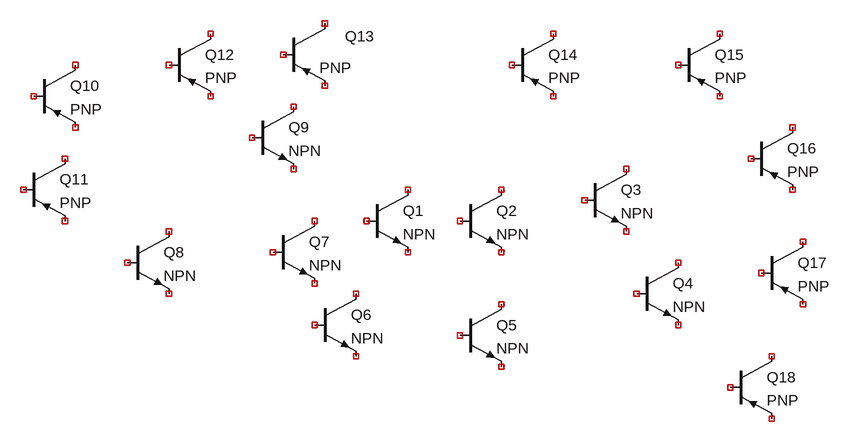
[diagram p0: schematic Draft1.asc]
Draft1.asc, the LTspice schematic file:
Version 4
SHEET 1 984 680
SYMBOL npn2 240 -208 R0
SYMATTR InstName Q1
SYMBOL npn2 384 -208 R0
SYMATTR InstName Q2
SYMBOL npn2 576 -240 R0
SYMATTR InstName Q3
SYMBOL npn2 656 -96 R0
SYMATTR InstName Q4
SYMBOL npn2 384 -32 R0
SYMATTR InstName Q5
SYMBOL npn2 160 -48 R0
SYMATTR InstName Q6
SYMBOL npn2 96 -160 R0
SYMATTR InstName Q7
SYMBOL npn2 -128 -144 R0
SYMATTR InstName Q8
SYMBOL npn2 64 -336 R0
SYMATTR InstName Q9
SYMBOL pnp2 -272 -400 R0
SYMATTR InstName Q10
SYMBOL pnp2 -288 -256 R0
SYMATTR InstName Q11
SYMBOL pnp2 -64 -448 R0
SYMATTR InstName Q12
SYMBOL pnp2 112 -464 R0
WINDOW 0 95 20 Left 2
SYMATTR InstName Q13
SYMBOL pnp2 464 -448 R0
SYMATTR InstName Q14
SYMBOL pnp2 720 -448 R0
SYMATTR InstName Q15
SYMBOL pnp2 832 -304 R0
SYMATTR InstName Q16
SYMBOL pnp2 848 -128 R0
SYMATTR InstName Q17
SYMBOL pnp2 800 48 R0
SYMATTR InstName Q18

The netlist it stands for:
* Draft1.asc
Q1 NC_01 NC_02 NC_03 0 NPN
Q2 NC_04 NC_05 NC_06 0 NPN
Q3 NC_07 NC_08 NC_09 0 NPN
Q4 NC_10 NC_11 NC_12 0 NPN
Q5 NC_13 NC_14 NC_15 0 NPN
Q6 NC_16 NC_17 NC_18 0 NPN
Q7 NC_19 NC_20 NC_21 0 NPN
Q8 NC_22 NC_23 NC_24 0 NPN
Q9 NC_25 NC_26 NC_27 0 NPN
Q10 NC_28 NC_29 NC_30 0 PNP
Q11 NC_31 NC_32 NC_33 0 PNP
Q12 NC_34 NC_35 NC_36 0 PNP
Q13 NC_37 NC_38 NC_39 0 PNP
Q14 NC_40 NC_41 NC_42 0 PNP
Q15 NC_43 NC_44 NC_45 0 PNP
Q16 NC_46 NC_47 NC_48 0 PNP
Q17 NC_49 NC_50 NC_51 0 PNP
Q18 NC_52 NC_53 NC_54 0 PNP
.model NPN NPN
.model PNP PNP
.lib standard.bjt
.backanno
.end